# EAGLE design 7segement2digits1badidea-mk-1 (EAGLE 6.4)
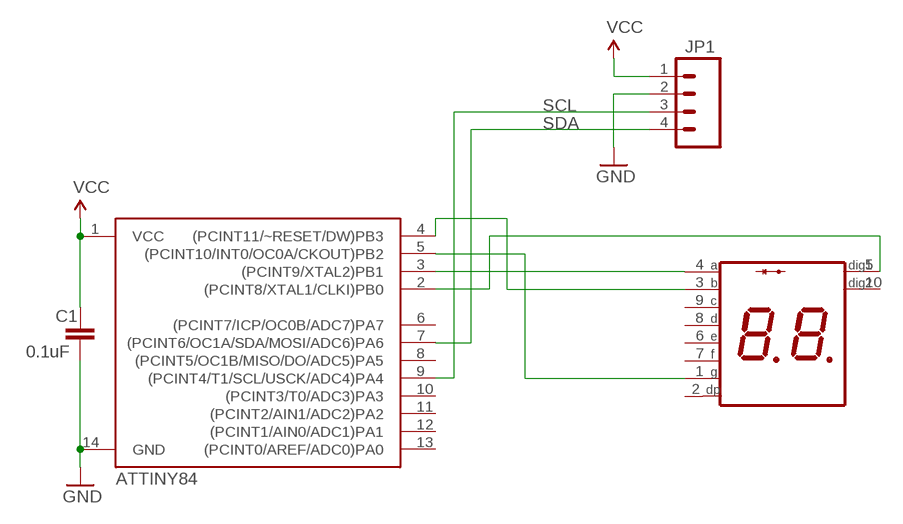
[diagram p0: schematic, sheet 1]

## Parts
C1  0.1uF  CAPPTH  [CAP-PTH-SMALL]
JP1  M04PTH  [1X04]
U$1  7SEG_2DIG_CA  [7SEG_2DIG_FUCKYOU]
U$2  ATTINY84  [SO14]

## Nets
GND: C1.2 JP1.2 U$2.14(GND)
N$1: U$1.5(DIG1) U$2.2((PCINT8/XTAL1/CLKI)PB0)
N$2: U$1.4(A) U$2.3((PCINT9/XTAL2)PB1)
N$3: U$1.3(B) U$2.4((PCINT11/~RESET/DW)PB3)
N$4: U$1.1(G) U$2.5((PCINT10/INT0/OC0A/CKOUT)PB2)
SCL: JP1.3 U$2.9((PCINT4/T1/SCL/USCK/ADC4)PA4)
SDA: JP1.4 U$2.7((PCINT6/OC1A/SDA/MOSI/ADC6)PA6)
VCC: C1.1 JP1.1 U$2.1(VCC)
Unconnected: U$1.2(DP) U$1.6(E) U$1.7(F) U$1.8(D) U$1.9(C) U$1.10(DIG2) U$2.6((PCINT7/ICP/OC0B/ADC7)PA7) U$2.8((PCINT5/OC1B/MISO/DO/ADC5)PA5) U$2.10((PCINT3/T0/ADC3)PA3) U$2.11((PCINT2/AIN1/ADC2)PA2) U$2.12((PCINT1/AIN0/ADC1)PA1) U$2.13((PCINT0/AREF/ADC0)PA0)

## Library data of the parts
C1 = SparkFun-Capacitors:CAP: Capacitor Standard 0603 ceramic capacitor, and 0.1" leaded capacitor.
JP1 = SparkFun-Connectors:M04: Header 4 Standard 4-pin 0.1" header. Use with straight break away headers (SKU : PRT-00116), right angle break away headers (PRT-00553), swiss pins (PRT-00743), machine pins (PRT-00117), and female headers (PRT-00115). Molex polarized connector foot print use with SKU : PRT-08231 with associated crimp pins and housings. 1MM SMD Version SKU: PRT-10208
U$1 = butts:7SEG_2DIG_CA
U$2 = SparkFun-DigitalIC:ATTINY84: Atmel 14-pin 2/4/8kB flash uC

## Board
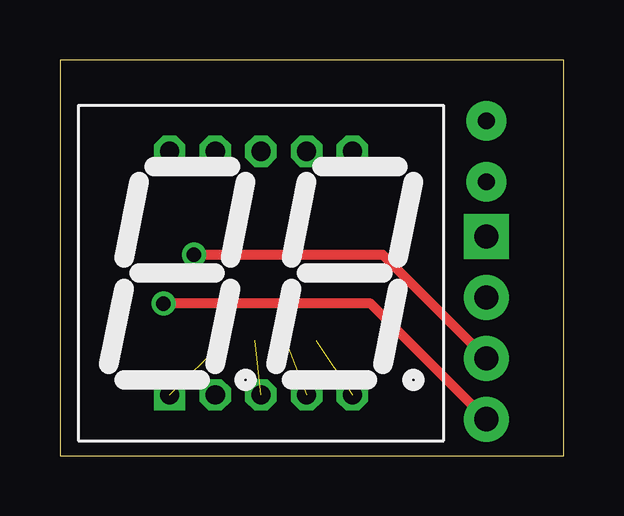
[diagram p1: board, top side]
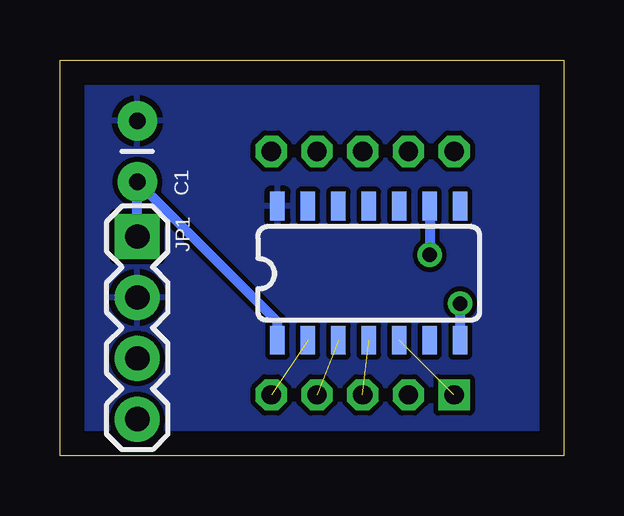
[diagram p2: board, bottom side, seen from below]

Size 21.01 x 16.51 mm. Coordinates in mm from the lower left corner, seen from the top.
Outline: 0,16.51 0,0 21.01,0 21.01,16.51 0,16.51
Copper layers (1*16): Top 0.035mm / dielectric 1.5mm / Bottom 0.035mm
Design rules "default": minimum track width 10mil, minimum drill 24mil, track to track 8mil, track to pad 8mil, pad to pad 8mil, via to via 8mil, smd to smd 8mil, copper to edge 40mil, drill to drill 8mil, minimum pad ring 10mil, minimum via ring 8mil, stop-mask expansion 4mil, vias tented up to drill 0mil, thermal gap 10mil

### Footprints (pad centres in the part's own frame; a part is rotated, then mirrored left to right if it is on the bottom)
CAP-PTH-SMALL = drill 0.7 pad 1.651: 1 0,0; 2 2.54,0
1X04 = drill 1.016 pad 1.88 square: 1 0,0 | drill 1.016 pad 1.88: 2 2.54,0; 3 5.08,0; 4 7.62,0
7SEG_2DIG_FUCKYOU = drill 0.8 square: 1 -3.81,-5.08 | drill 0.8 octagon: 2 -1.905,-5.08; 3 0,-5.08; 4 1.905,-5.08; 5 3.81,-5.08; 6 3.81,5.08; 7 1.905,5.08; 8 0,5.08; 9 -1.905,5.08; 10 -3.81,5.08
SO14 = smd 0.6 x 1.2: 1 -3.81,-2.8; 2 -2.54,-2.8; 3 -1.27,-2.8; 4 0,-2.8; 5 1.27,-2.8; 6 2.54,-2.8; 7 3.81,-2.8; 8 3.81,2.8; 9 2.54,2.8; 10 1.27,2.8; 11 0,2.8; 12 -1.27,2.8; 13 -2.54,2.8; 14 -3.81,2.8

### Placement (x,y rotation side)
C1  17.78,11.43 90 bottom
JP1  17.78,9.14 270 bottom
U$1  8.38,7.62 0 top
U$2  8.13,7.62 0 bottom

### Tracks (layer width: path | path; a pad name or v marks a point on that pad's centre or on a via)
GND
  pour Bottom: 0,16.51 20.83,16.51 20.83,0 0,0
N$1  (1 unrouted)
N$2  (1 unrouted)
N$3  (1 unrouted)
N$4  (1 unrouted)
SCL  (via drill 0.6)
  Top 0.406: JP1.3 13.46,8.38 v5.59,8.38
  Bottom 0.406: U$2.9 v5.59,8.38
SDA  (via drill 0.6)
  Top 0.406: JP1.4 12.95,6.35 v4.32,6.35
  Bottom 0.406: U$2.7 v4.32,6.35
VCC
  Bottom 0.406: JP1.1 C1.1 11.94,5.59 U$2.1